# EAGLE design metal_detector (EAGLE 6.1)
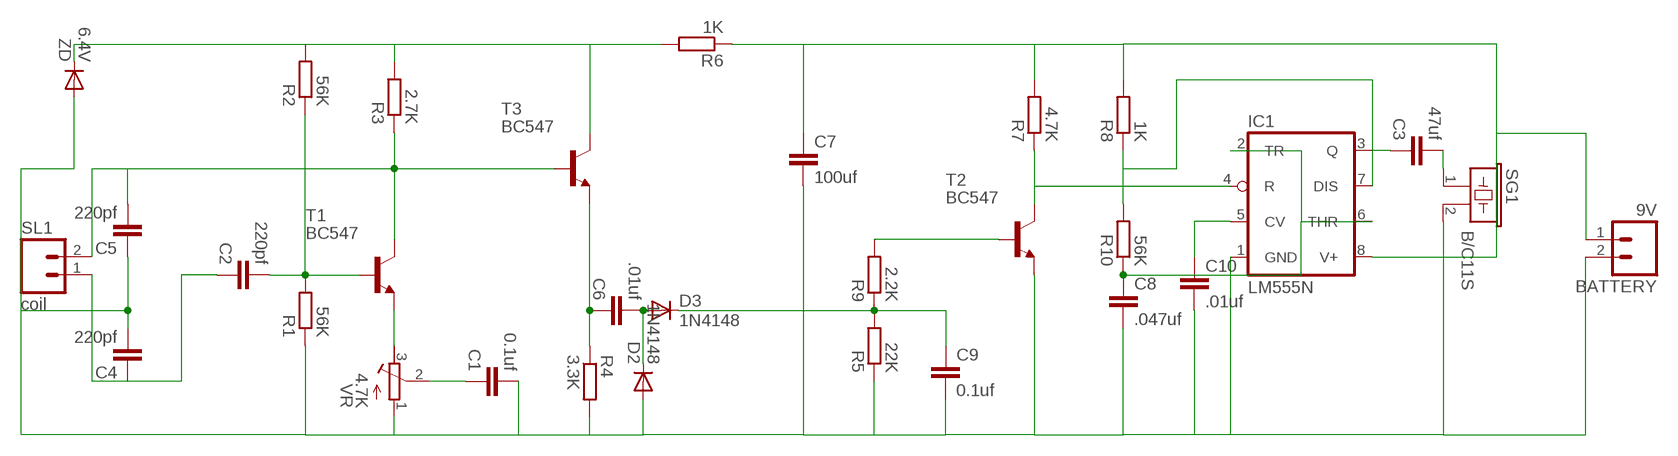
[diagram p0: schematic, sheet 1]

## Parts
BATTERY  9V  M02  [02P]
C1  0.1uf  C2.5/4  [C2.5-4]
C2  220pf  C2.5/4  [C2.5-4]
C3  47uf  C2.5/4  [C2.5-4]
C4  220pf  C2.5/4  [C2.5-4]
C5  220pf  C2.5/4  [C2.5-4]
C6  .01uf  C2.5/4  [C2.5-4]
C7  100uf  C2.5/4  [C2.5-4]
C8  .047uf  C2.5/4  [C2.5-4]
C9  0.1uf  C2.5/4  [C2.5-4]
C10  .01uf  C2.5/4  [C2.5-4]
D2  1N4148  1N4004  [DO41-10]
D3  1N4148  1N4004  [DO41-10]
IC1  LM555N  [DIL08]
R1  56K  R-EU_0204/7  [0204/7]
R2  56K  R-EU_0204/7  [0204/7]
R3  2.7K  R-EU_0204/7  [0204/7]
R4  3.3K  R-EU_0204/7  [0204/7]
R5  22K  R-EU_0204/7  [0204/7]
R6  1K  R-EU_0204/7  [0204/7]
R7  4.7K  R-EU_0204/7  [0204/7]
R8  1K  R-EU_0204/7  [0204/7]
R9  2.2K  R-EU_0204/7  [0204/7]
R10  56K  R-EU_0204/7  [0204/7]
SG1  B/C11S  [B/C11S]
SL1  coil  M02  [02P]
T1  BC547  [TO92]
T2  BC547  [TO92]
T3  BC547  [TO92]
VR  4.7K  R-TRIMM64P  [RTRIM64P]
ZD  6.4V  1N4004  [DO41-10]

## Nets
N$1: C2.2 R1.2 R2.1 T1.2(B)
N$2: C5.2 R3.1 SL1.2 T1.3(C) T3.2(B)
N$3: BATTERY.1 C7.1 IC1.8(V+) R6.1 R7.2 R8.2
N$4: C2.1 C4.1 SL1.1
N$5: BATTERY.2 C1.2 C4.2 C5.1 C7.2 C8.2 C9.2 C10.2 D2.A IC1.1(GND) R1.1 R4.2 R5.1 SG1.2 T2.1(E) VR.1(E) ZD.A
N$6: IC1.4(R) R7.1 T2.3(C)
N$7: IC1.7(DIS) R8.1 R10.2
N$8: C8.1 IC1.2(TR) IC1.6(THR) R10.1
N$9: T1.1(E) VR.3(A)
N$10: C1.1 VR.2(S)
N$11: C6.1 R4.1 T3.1(E)
N$12: C6.2 D2.C D3.A
N$13: C3.2 SG1.1
N$14: C9.1 D3.C R5.2 R9.1
N$15: R9.2 T2.2(B)
N$16: C10.1 IC1.5(CV)
N$17: R2.2 R3.2 R6.2 T3.3(C) ZD.C
N$18: C3.1 IC1.3(Q)

## Library data of the parts
BATTERY SL1 = con-amp-quick:M02: AMP QUICK CONNECTOR; OC_FARNELL: unknown; OC_NEWARK: unknown
C1-C10 = capacitor-wima:C: CAPACITOR naming: grid - package width
D2 D3 ZD = diode:1N4004: DIODE general purpose rectifier, 1 A
IC1 = linear:*555: TIMER
R1-R10 = rcl:R-EU_: RESISTOR, European symbol
SG1 = buzzer:B/C11S: BUZZER Source: Buerklin; OC_FARNELL: unknown; OC_NEWARK: unknown
T1-T3 = transistor:BC547: NPN TRANSISTOR
VR = resistor:R-TRIMM: Trimm resistor

## Board
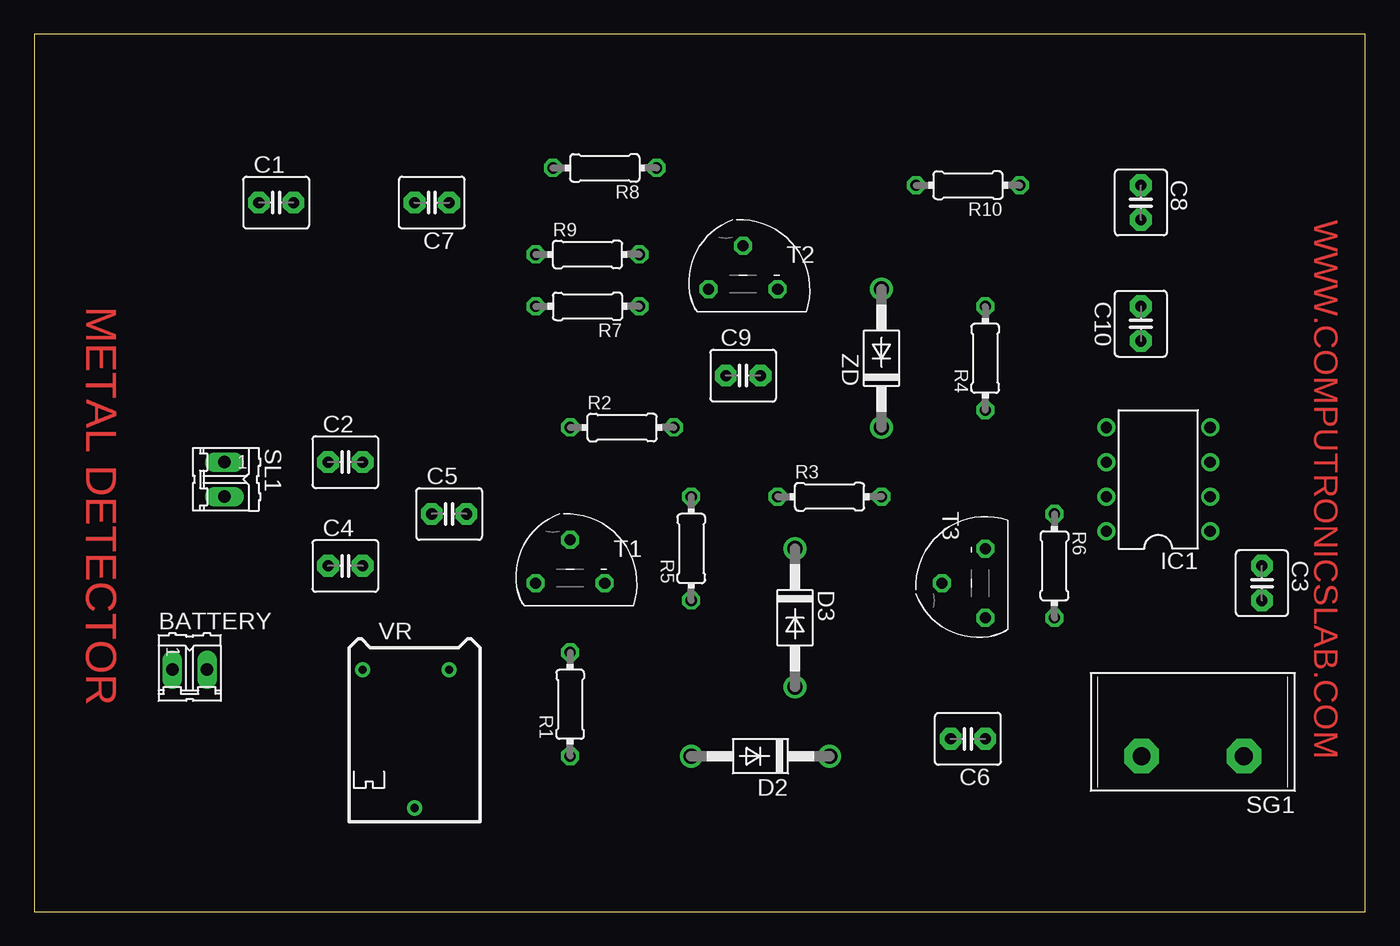
[diagram p1: board, top side]
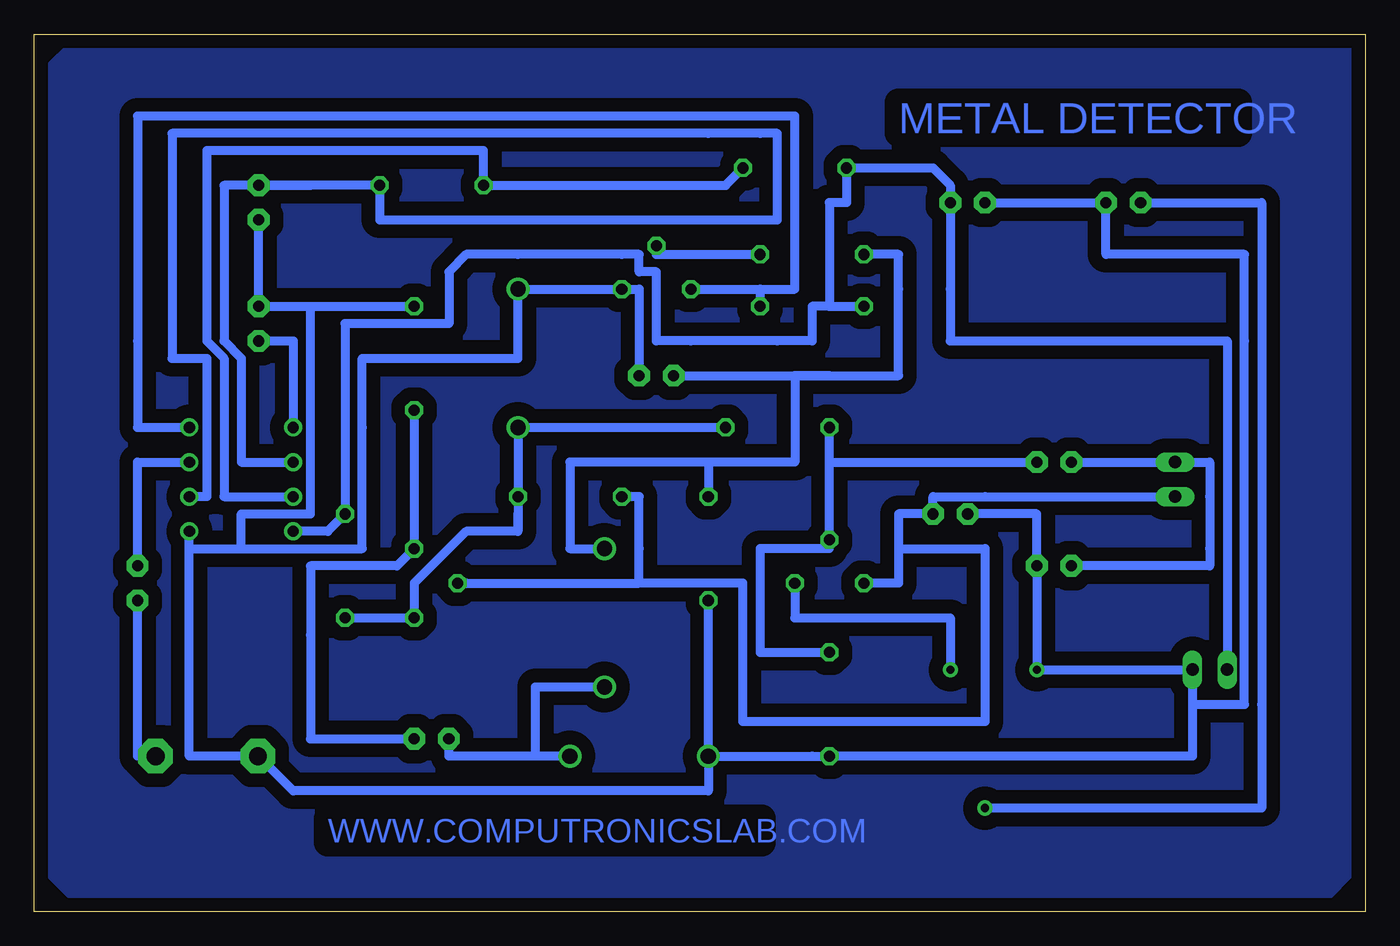
[diagram p2: board, bottom side, seen from below]

Size 97.77 x 64.44 mm. Coordinates in mm from the lower left corner, seen from the top.
Outline: 0,0 97.77,0 97.77,64.44 0,64.44 0,0
Copper layers (1*16): Top 0.035mm / dielectric 1.5mm / Bottom 0.035mm
Design rules: minimum track width 26mil, minimum drill 24mil, track to track 8mil, track to pad 8mil, pad to pad 8mil, via to via 8mil, smd to smd 8mil, copper to edge 40mil, drill to drill 8mil, minimum pad ring 10mil, minimum via ring 8mil, stop-mask expansion 4mil, vias tented up to drill 0mil, thermal gap 10mil

### Footprints (pad centres in the part's own frame; a part is rotated, then mirrored left to right if it is on the bottom)
02P = drill 0.914 long: 1 -1.27,0; 2 1.27,0
C2.5-4 = drill 0.813 pad 1.6 octagon: 1 -1.27,0; 2 1.27,0
DO41-10 = drill 1.118: A 5.08,0; C -5.08,0
DIL08 = drill 0.813 pad 1.27: 1 -3.81,-3.81; 2 -1.27,-3.81; 3 1.27,-3.81; 4 3.81,-3.81; 5 3.81,3.81; 6 1.27,3.81; 7 -1.27,3.81; 8 -3.81,3.81
0204/7 = drill 0.813 octagon: 1 -3.81,0; 2 3.81,0
B/C11S = drill 1.321 pad 2.54 octagon: 1 -3.759,0; 2 3.759,0
TO92 = drill 0.813 octagon: 1 2.54,-1.27; 2 0,1.905; 3 -2.54,-1.27
RTRIM64P = drill 0.61: 1 -2.54,-3.81; 2 7.62,0; 3 -2.54,2.54

### Placement (x,y rotation side)
BATTERY  11.43,17.78 0 top
C1  17.78,52.07 0 top
C2  22.86,33.02 0 top
C3  90.17,24.13 270 top
C4  22.86,25.4 0 top
C5  30.48,29.21 0 top
C6  68.58,12.7 180 top
C7  29.21,52.07 180 top
C8  81.28,52.07 270 top
C9  52.07,39.37 0 top
C10  81.28,43.18 90 top
D2  53.34,11.43 180 top
D3  55.88,21.59 270 top
IC1  82.55,31.75 90 top
R1  39.37,15.24 90 top
R2  43.18,35.56 0 top
R3  58.42,30.48 0 top
R4  69.85,40.64 90 top
R5  48.26,26.67 90 top
R6  74.93,25.4 270 top
R7  40.64,44.45 180 top
R8  41.91,54.61 180 top
R9  40.64,48.26 0 top
R10  68.58,53.34 180 top
SG1  85.09,11.43 180 top
SL1  13.97,31.75 270 top
T1  39.37,25.4 0 top
T2  52.07,46.99 0 top
T3  68.58,24.13 90 top
VR  27.94,15.24 270 top
ZD  62.23,40.64 90 top

### Tracks (layer width: path | path; a pad name or v marks a point on that pad's centre or on a via)
N$1
  Bottom 0.66: R1.2 44.45,19.05 44.45,22.86 44.45,26.67 39.37,26.67 T1.2 39.37,27.94 39.37,33.02 | 39.37,33.02 R2.1 | 39.37,33.02 C2.2
N$2
  Bottom 0.66: R3.1 53.34,30.48 53.34,26.67 53.34,24.13 | 53.34,24.13 66.04,24.13 T3.2 | 34.29,26.67 34.29,29.21 C5.2 31.75,30.48 27.94,30.48 SL1.2 | 34.29,26.67 34.29,24.13 T1.3 | 53.34,24.13 45.72,24.13 45.72,19.05 45.72,16.51 45.72,13.97 36.83,13.97 27.94,13.97 27.94,26.67 34.29,26.67
N$3
  Bottom 0.66: BATTERY.1 10.16,41.91 20.32,41.91 30.48,41.91 30.48,45.72 C7.1 30.48,53.34 31.75,54.61 R8.2 38.1,52.07 39.37,52.07 39.37,44.45 | IC1.8 76.2,27.94 R6.1 74.93,43.18 67.31,43.18 67.31,46.99 66.04,48.26 62.23,48.26 54.61,48.26 53.34,48.26 53.34,46.99 52.07,46.99 52.07,41.91 49.53,41.91 43.18,41.91 40.64,41.91 40.64,44.45 39.37,44.45 | 39.37,44.45 R7.2
N$4
  Bottom 0.66: C2.1 SL1.1 11.43,33.02 11.43,30.48 11.43,26.67 11.43,25.4 C4.1
N$5
  Bottom 0.66: 77.47,44.45 C10.2 C8.2 | 77.47,44.45 R4.2 | C9.2 53.34,45.72 T2.1 ZD.A 62.23,40.64 69.85,40.64 73.66,40.64 73.66,35.56 73.66,26.67 82.55,26.67 | 86.36,26.67 86.36,11.43 82.55,11.43 SG1.2 81.28,11.43 78.74,8.89 48.26,8.89 D2.A | 86.36,26.67 IC1.1 | 86.36,26.67 82.55,26.67 | 77.47,44.45 77.47,29.21 82.55,29.21 82.55,26.67 | D2.A 40.64,11.43 R1.1 12.7,11.43 12.7,15.24 | D2.A R5.1 | C7.2 C1.2 19.05,48.26 8.89,48.26 8.89,41.91 8.89,15.24 12.7,15.24 | C5.1 24.13,29.21 C4.2 VR.1 BATTERY.2 12.7,15.24
N$6
  Bottom 0.66: 44.45,45.72 R7.1 | T2.3 44.45,45.72 | IC1.4 90.17,35.56 90.17,41.91 90.17,58.42 48.26,58.42 44.45,58.42 41.91,58.42 41.91,53.34 41.91,45.72 44.45,45.72
N$7
  Bottom 0.66: R8.1 46.99,53.34 R10.2 64.77,55.88 68.58,55.88 85.09,55.88 85.09,41.91 83.82,40.64 83.82,30.48 IC1.7
N$8
  Bottom 0.66: IC1.6 82.55,33.02 82.55,40.64 83.82,41.91 83.82,53.34 C8.1 | IC1.2 85.09,30.48 85.09,40.64 87.63,40.64 87.63,57.15 48.26,57.15 44.45,57.15 43.18,57.15 43.18,53.34 43.18,50.8 71.12,50.8 72.39,50.8 R10.1 77.47,53.34 | 77.47,53.34 C8.1 | 77.47,53.34 C8.1 | C8.1 77.47,53.34
N$9
  Bottom 0.66: VR.3 30.48,21.59 41.91,21.59 T1.1
N$10
  Bottom 0.66: VR.2 8.89,7.62 7.62,7.62 7.62,15.24 7.62,52.07 C1.1
N$11
  Bottom 0.66: R4.1 T3.1 71.12,25.4 77.47,25.4 77.47,20.32 77.47,12.7 C6.1
N$12
  Bottom 0.66: C6.2 67.31,11.43 60.96,11.43 | D2.C 60.96,11.43 | 60.96,11.43 60.96,16.51 D3.A
N$13
  Bottom 0.66: C3.2 90.17,11.43 88.9,11.43 SG1.1
N$14
  Bottom 0.66: R9.1 34.29,48.26 34.29,45.72 34.29,39.37 39.37,39.37 | C9.1 39.37,39.37 | 39.37,39.37 41.91,39.37 41.91,33.02 48.26,33.02 | 48.26,33.02 R5.2 | D3.C 58.42,26.67 58.42,33.02 48.26,33.02
N$15
  Bottom 0.66: R9.2 52.07,48.26 T2.2
N$16
  Bottom 0.66: IC1.5 78.74,41.91 C10.1
N$17
  Bottom 0.66: R6.2 T3.3 69.85,24.13 68.58,25.4 66.04,27.94 62.23,27.94 | R2.2 ZD.C R3.2 62.23,29.21 | 62.23,29.21 62.23,27.94 | 62.23,29.21 62.23,27.94 | 62.23,27.94 62.23,29.21
N$18
  Bottom 0.66: IC1.3 90.17,33.02 C3.1
N$19
  pour Bottom (isolate 1.016): 6.35,0 3.81,0 0,3.81 0,62.23 2.54,64.77 93.98,64.77 97.79,60.96 97.79,3.81 93.98,0

### Text on the board
Top: WWW.COMPUTRONICSLAB.COM | METAL DETECTOR
Bottom: METAL DETECTOR | WWW.COMPUTRONICSLAB.COM